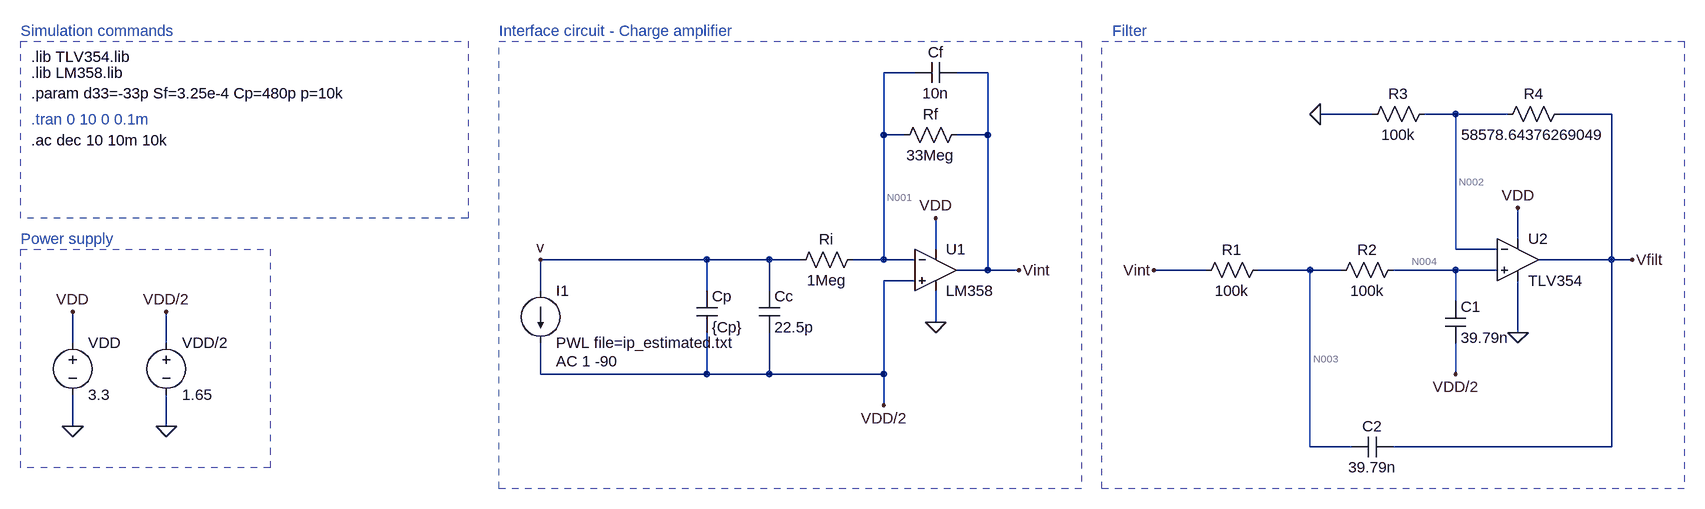
[diagram p0: schematic charge_amplifier.asc]
charge_amplifier.asc, the LTspice schematic file:
Version 4
SHEET 1 2148 680
WIRE 944 -320 896 -320
WIRE 1056 -320 1008 -320
WIRE 1648 -256 1568 -256
WIRE 1776 -256 1728 -256
WIRE 1856 -256 1776 -256
WIRE 2016 -256 1936 -256
WIRE 896 -224 896 -320
WIRE 928 -224 896 -224
WIRE 1056 -224 1056 -320
WIRE 1056 -224 1008 -224
WIRE 1872 -64 1872 -112
WIRE 976 -48 976 -96
WIRE 1776 -48 1776 -256
WIRE 1840 -48 1776 -48
WIRE 624 -32 368 -32
WIRE 720 -32 624 -32
WIRE 768 -32 720 -32
WIRE 896 -32 896 -224
WIRE 896 -32 848 -32
WIRE 944 -32 896 -32
WIRE 2016 -32 2016 -256
WIRE 2016 -32 1904 -32
WIRE 2048 -32 2016 -32
WIRE 1056 -16 1056 -224
WIRE 1056 -16 1008 -16
WIRE 1104 -16 1056 -16
WIRE 1392 -16 1312 -16
WIRE 1552 -16 1472 -16
WIRE 1600 -16 1552 -16
WIRE 1776 -16 1680 -16
WIRE 1840 -16 1776 -16
WIRE 944 0 896 0
WIRE 368 16 368 -32
WIRE 624 16 624 -32
WIRE 720 16 720 -32
WIRE 1776 32 1776 -16
WIRE 976 64 976 16
WIRE 1872 80 1872 0
WIRE -352 96 -352 48
WIRE -208 96 -208 48
WIRE 368 144 368 96
WIRE 624 144 624 80
WIRE 624 144 368 144
WIRE 720 144 720 80
WIRE 720 144 624 144
WIRE 896 144 896 0
WIRE 896 144 720 144
WIRE 1776 144 1776 96
WIRE 896 192 896 144
WIRE -352 224 -352 176
WIRE -208 224 -208 176
WIRE 1552 256 1552 -16
WIRE 1616 256 1552 256
WIRE 2016 256 2016 -32
WIRE 2016 256 1680 256
FLAG -352 224 0
FLAG -352 48 VDD
FLAG 976 64 0
FLAG 976 -96 VDD
FLAG 896 192 VDD/2
FLAG -208 224 0
FLAG -208 48 VDD/2
FLAG 1104 -16 Vint
FLAG 1312 -16 Vint
FLAG 1872 80 0
FLAG 1872 -112 VDD
FLAG 2048 -32 Vfilt
FLAG 1568 -256 0
FLAG 1776 144 VDD/2
FLAG 368 -32 v
SYMBOL voltage -352 80 R0
WINDOW 123 0 0 Left 0
WINDOW 39 0 0 Left 0
SYMATTR InstName VDD
SYMATTR Value 3.3
SYMBOL Opamps\\opamp2 976 -80 R0
SYMATTR InstName U1
SYMATTR Value LM358
SYMBOL res 864 -48 R90
WINDOW 0 0 56 VBottom 2
WINDOW 3 32 56 VTop 2
SYMATTR InstName Ri
SYMATTR Value 1Meg
SYMBOL cap 704 16 R0
SYMATTR InstName Cc
SYMATTR Value 22.5p
SYMBOL cap 608 16 R0
SYMATTR InstName Cp
SYMATTR Value {Cp}
SYMBOL voltage -208 80 R0
WINDOW 123 0 0 Left 0
WINDOW 39 0 0 Left 0
SYMATTR InstName VDD/2
SYMATTR Value 1.65
SYMBOL res 1024 -240 R90
WINDOW 0 0 56 VBottom 2
WINDOW 3 32 56 VTop 2
SYMATTR InstName Rf
SYMATTR Value 33Meg
SYMBOL cap 1008 -336 R90
WINDOW 0 0 32 VBottom 2
WINDOW 3 32 32 VTop 2
SYMATTR InstName Cf
SYMATTR Value 10n
SYMBOL current 368 16 R0
WINDOW 123 24 108 Left 2
WINDOW 39 0 0 Left 0
SYMATTR Value2 AC 1 -90
SYMATTR InstName I1
SYMATTR Value PWL file=ip_estimated.txt
SYMBOL Opamps\\opamp2 1872 -96 R0
SYMATTR InstName U2
SYMATTR Value TLV354
SYMBOL res 1488 -32 R90
WINDOW 0 0 56 VBottom 2
WINDOW 3 32 56 VTop 2
SYMATTR InstName R1
SYMATTR Value 100k
SYMBOL res 1952 -272 R90
WINDOW 0 0 56 VBottom 2
WINDOW 3 32 56 VTop 2
SYMATTR InstName R4
SYMATTR Value 58578.64376269049
SYMBOL res 1744 -272 R90
WINDOW 0 0 56 VBottom 2
WINDOW 3 32 56 VTop 2
SYMATTR InstName R3
SYMATTR Value 100k
SYMBOL res 1696 -32 R90
WINDOW 0 0 56 VBottom 2
WINDOW 3 32 56 VTop 2
SYMATTR InstName R2
SYMATTR Value 100k
SYMBOL cap 1760 32 R0
SYMATTR InstName C1
SYMATTR Value 39.79n
SYMBOL cap 1680 240 R90
WINDOW 0 0 32 VBottom 2
WINDOW 3 32 32 VTop 2
SYMATTR InstName C2
SYMATTR Value 39.79n
TEXT -416 -320 Left 2 !.lib LM358.lib
TEXT -416 -288 Left 2 !.param d33=-33p Sf=3.25e-4 Cp=480p p=10k
TEXT -416 -248 Left 2 ;.tran 0 10 0 0.1m
TEXT -432 -64 Left 2 ;Power supply
TEXT -432 -384 Left 2 ;Simulation commands
TEXT 304 -384 Left 2 ;Interface circuit - Charge amplifier
TEXT -416 -216 Left 2 !.ac dec 10 10m 10k
TEXT 1248 -384 Left 2 ;Filter
TEXT -416 -344 Left 2 !.lib TLV354.lib
RECTANGLE Normal -48 288 -432 -48 2
RECTANGLE Normal 256 -96 -432 -368 2
RECTANGLE Normal 1200 320 304 -368 2
RECTANGLE Normal 2128 320 1232 -368 2

The netlist it stands for:
* charge_amplifier.asc
VDD VDD 0 3.3
XU1 VDD/2 N001 VDD 0 Vint LM358  ; pins In+ In- V+ V- OUT
Ri N001 v 1Meg
Cc v VDD/2 22.5p
Cp v VDD/2 {Cp}
VDD/2 VDD/2 0 1.65
Rf Vint N001 33Meg
Cf Vint N001 10n
I1 v VDD/2 PWL file=ip_estimated.txt AC 1 -90
XU2 N004 N002 VDD 0 Vfilt TLV354  ; pins In+ In- V+ V- OUT
R1 N003 Vint 100k
R4 Vfilt N002 58578.64376269049
R3 N002 0 100k
R2 N004 N003 100k
C1 N004 VDD/2 39.79n
C2 Vfilt N003 39.79n
.lib LM358.lib
.param d33=-33p Sf=3.25e-4 Cp=480p p=10k
* .tran 0 10 0 0.1m
* Power supply
* Simulation commands
* Interface circuit - Charge amplifier
.ac dec 10 10m 10k
* Filter
.lib TLV354.lib
.backanno
.end

* Results of the author's LTspice run, read from the files saved beside the schematic
* Operating Point, zero values left out:
*   V(vdd) = 3.3 V
*   V(n001) = 1.652 V
*   V(vdd/2) = 1.65 V
*   V(vint) = 400 mV
*   V(v) = 1.652 V
*   V(vfilt) = 636.6 mV
*   V(n002) = 401.4 mV
*   V(n004) = 400 mV
*   V(n003) = 400 mV
*   I(Rf) = -37.94 nA
*   I(R1) = 3.153 pA
*   I(R4) = 4.014 µA
*   I(R3) = 4.014 µA
*   I(R2) = 3.153 pA
*   I(Vdd) = -5.143 mA
*   I(Vdd/2) = 51.99 nA
*   Ix(u1:1) = -51.99 nA
*   Ix(u1:2) = -37.94 nA
*   Ix(u1:99) = -60.59 µA
*   Ix(u1:50) = 60.64 µA
*   Ix(u1:28) = 37.94 nA
*   Ix(u2:IN+) = -3.168 pA
*   Ix(u2:IN-) = -4.273 pA
*   Ix(u2:VCC) = 5.204 mA
*   Ix(u2:VEE) = -5.2 mA
*   Ix(u2:OUT) = -4.014 µA
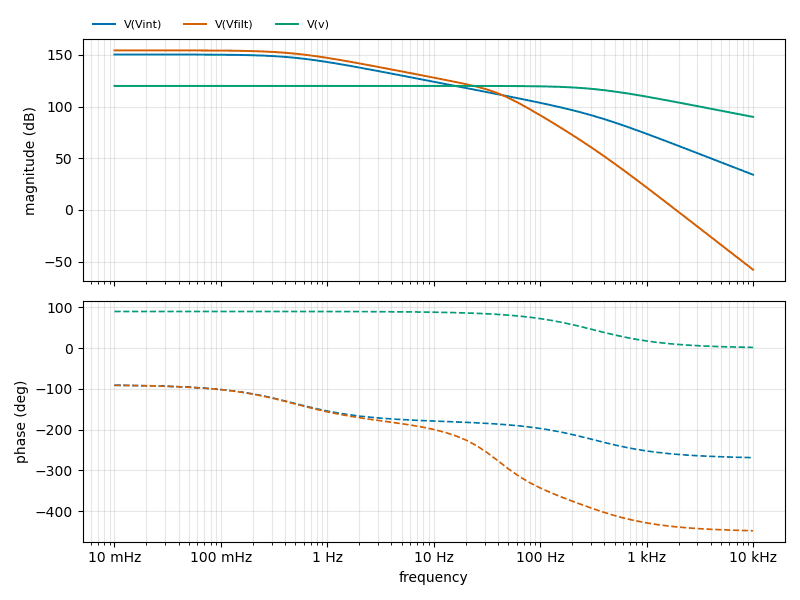
[diagram p1: AC Analysis of charge_amplifier.asc, plotted from the saved traces]
* AC Analysis, 1 run:
*   V(Vint): 150.36 dB at 10 mHz, 34.07 dB at 10 kHz, peak 150.36 dB at 10 mHz, 3 dB below the peak at 480.9 mHz
*   V(Vfilt): 154.37 dB at 10 mHz, -57.85 dB at 10 kHz, peak 154.37 dB at 10 mHz, 3 dB below the peak at 480.9 mHz
*   V(v): 120.00 dB at 10 mHz, 90.01 dB at 10 kHz, peak 120.00 dB at 10 mHz, 3 dB below the peak at 316.5 Hz